# EAGLE design serializer (EAGLE 8.0.0)
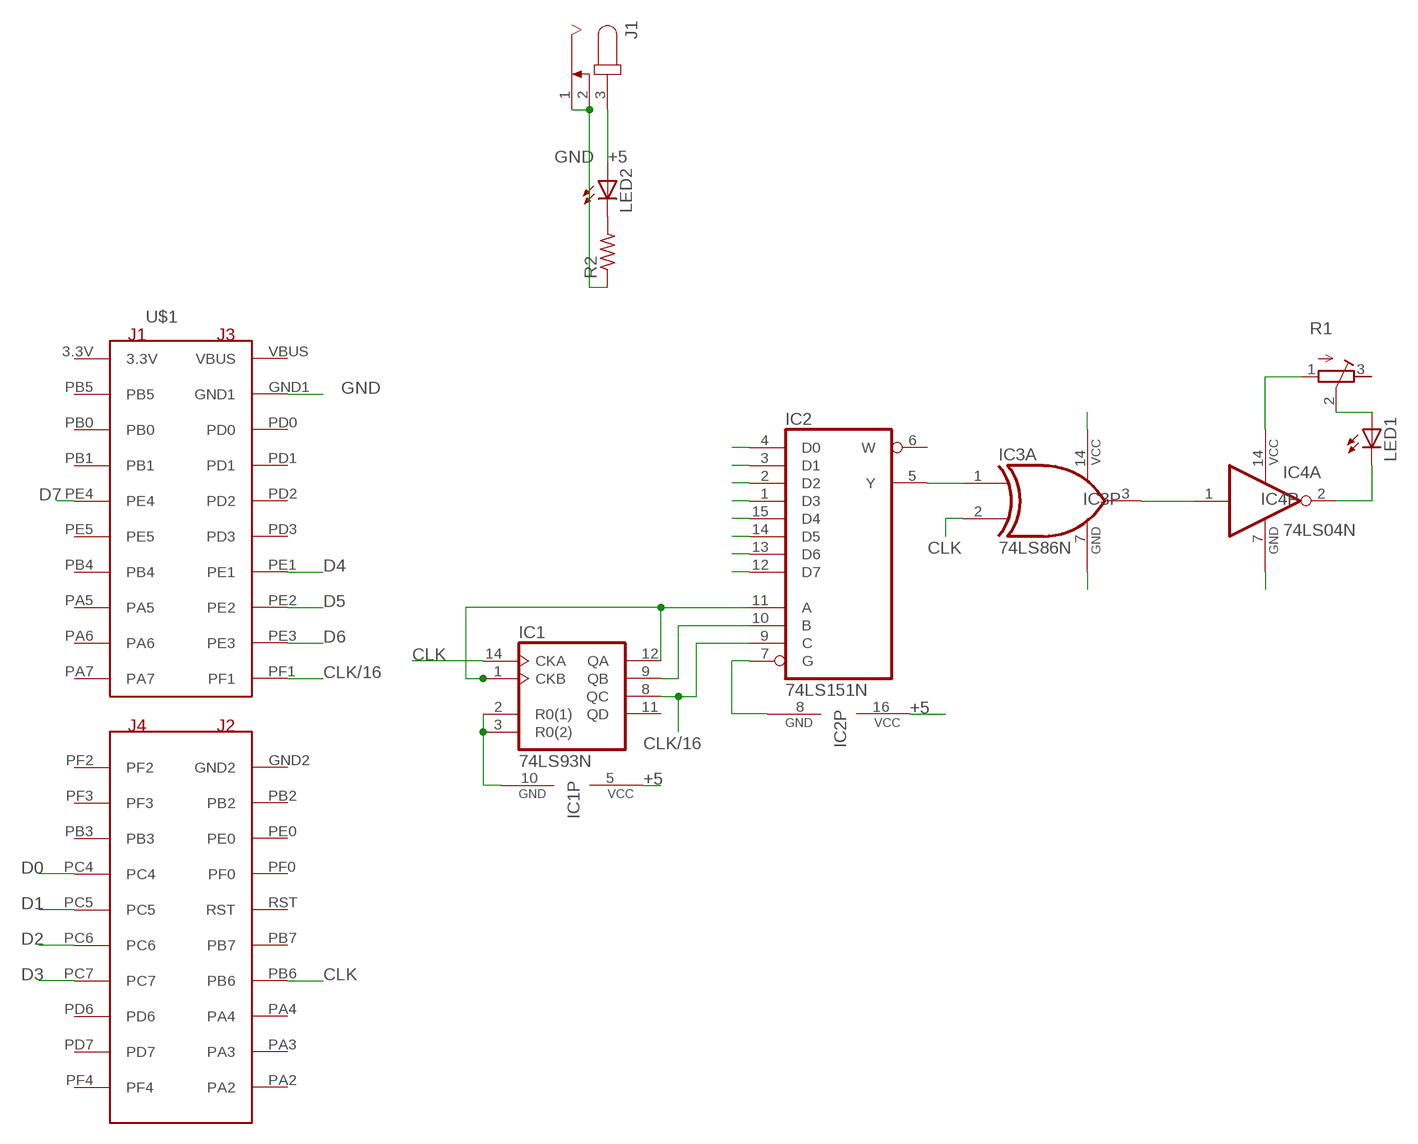
[diagram p0: schematic, sheet 1]

## Parts
IC1  74LS93N  [DIL14]
IC2  74LS151N  [DIL16]
IC3  74LS86N  [DIL14]
IC4  74LS04N  [DIL14]
J1  JACK-PLUG0  [SPC4077]
LED1  LED5MM  [LED5MM]
LED2  LED5MM  [LED5MM]
R1  R-TRIMM3296Y  [RTRIM3296Y]
R2  R-US_0207/10  [0207/10]
U$1  STELLARIS_LAUNCHPAD_BLIZZARD_XL_HEADERS  [STELLARISLAUNCHPADHEADERS]

## Nets
+5: IC1.5(VCC) IC2.16(VCC) IC3.14(P:VCC) IC4.14(P:VCC) J1.3 LED2.A R1.1(A)
CLK: IC1.14(CKA) IC3.2(A:I1) U$1.PB6
CLK/16: IC1.8(QC) IC2.9(C) U$1.PF1
D0: IC2.4(D0) U$1.PC4
D1: IC2.3(D1) U$1.PC5
D2: IC2.2(D2) U$1.PC6
D3: IC2.1(D3) U$1.PC7
D4: IC2.15(D4) U$1.PE1
D5: IC2.14(D5) U$1.PE2
D6: IC2.13(D6) U$1.PE3
D7: IC2.12(D7) U$1.PE4
GND: IC1.2(R0(1)) IC1.3(R0(2)) IC1.10(GND) IC2.7(G) IC2.8(GND) IC3.7(P:GND) IC4.7(P:GND) J1.1 J1.2 R2.1 U$1.GND1
N$1: IC1.9(QB) IC2.10(B)
N$2: LED2.K(C) R2.2
N$3: IC1.1(CKB) IC1.12(QA) IC2.11(A)
N$4: IC3.3(A:O) IC4.1(A:I)
N$5: LED1.A R1.2(S)
N$6: IC4.2(A:O) LED1.K(C)
SEROUT: IC2.5(Y) IC3.1(A:I0)
Unconnected: IC1.11(QD) IC2.6(W) IC3.4(B:I0) IC3.5(B:I1) IC3.6(B:O) IC3.8(C:O) IC3.9(C:I0) IC3.10(C:I1) IC3.11(D:O) IC3.12(D:I0) IC3.13(D:I1) IC4.3(B:I) IC4.4(B:O) IC4.5(C:I) IC4.6(C:O) IC4.8(D:O) IC4.9(D:I) IC4.10(E:O) IC4.11(E:I) IC4.12(F:O) IC4.13(F:I) R1.3(E) U$1.PA2 U$1.PA3 U$1.PA4 U$1.PA5 U$1.PA6 U$1.PA7 U$1.PB0 U$1.PB1 U$1.PB2 U$1.PB3 U$1.PB4 U$1.PB5 U$1.PB7 U$1.PD0 U$1.PD1 U$1.PD2 U$1.PD3 U$1.PD6 U$1.PD7 U$1.PE0 U$1.PE5 U$1.PF0 U$1.PF2 U$1.PF3 U$1.PF4

## Power pins joined to a net without a drawn wire
3.3V: U$1.3.3V
GND2: U$1.GND2
RST: U$1.RST
VBUS: U$1.VBUS

## Library data of the parts
IC1 = 74xx-us:74*93: Decade, divide by twelve and binary COUNTER
IC2 = 74xx-us:74*151: Data SELECTOR/MULTIPLEXER
IC3 = 74xx-us:74*86: Quad 2-input EXCLUSIV-OR (XOR) gate
IC4 = 74xx-us:74*04: Hex INVERTER
J1 = con-jack:JACK-PLUG: DC POWER JACK Power Jack, DC, Right Angle, Through Hole, Rated 5A at 16VDC, PC Terminals Distributor: Farnell (www.Farnell.de) Drawing: 84N1161.pdf / 84N1162.pdf Manufacturer: SPC Technology (www.spctechnology.com) Type: SPC4077 / SPC 4078; OC_FARNELL: unknown; OC_NEWARK: unknown
LED1 LED2 = led:LED: LED OSRAM: - CHIPLED LG R971, LG N971, LY N971, LG Q971, LY Q971, LO R971, LY R971 LH N974, LH R974 LS Q976, LO Q976, LY Q976 LO Q996 - Hyper CHIPLED LW Q18S LB Q993, LB Q99A, LB R99A - SideLED LS A670, LO A670, LY A670, LG A670, LP A670 LB A673, LV A673, LT A673, LW A673 LH A674 LY A675 LS A676, LA A676, LO A676, LY A676, LW A676 LS A679, LY A679, LG A679 - Hyper Micro SIDELED® LS Y876, LA Y876, LO Y876, LY Y876 LT Y87S - SmartLED LW L88C, LW L88S LB L89C, LB L89S, LG L890 LS L89K, LO L89K, LY L89K LS L896, LA L896, LO L896, LY L896 - TOPLED LS T670, LO T670, LY T670, LG T670, LP T670 LSG T670, LSP T670, LSY T670, LOP T670, LYG T670 LG T671, LOG T671, LSG T671 LB T673, LV T673, LT T673, LW T673 LH T674 LS T676, LA T676, LO T676, LY T676, LB T676, LH T676, LSB T676, LW T676 LB T67C, LV T67C, LT T67C, LS T67K, LO T67K, LY T67K, LW E67C LS E67B, LA E67B, LO E67B, LY E67B, LB E67C, LV E67C, LT E67C LW T67C LS T679, LY T679, LG T679 LS T770, LO T770, LY T770, LG T770, LP T770 LB T773, LV T773, LT T773, LW T773 LH T774 LS E675, LA E675, LY E675, LS T675 LS T776, LA T776, LO T776, LY T776, LB T776 LHGB T686 LT T68C, LB T68C - Hyper Mini TOPLED® LB M676 - Mini TOPLED Santana® LG M470 LS M47K, LO M47K, LY M47K Source: http://www.osram.convergy.de LUXEON: - LUMILED® LXK2-PW12-R00, LXK2-PW12-S00, LXK2-PW14-U00, LXK2-PW14-V00 LXK2-PM12-R00, LXK2-PM12-S00, LXK2-PM14-U00 LXK2-PE12-Q00, LXK2-PE12-R00, LXK2-PE12-S00, LXK2-PE14-T00, LXK2-PE14-U00 LXK2-PB12-K00, LXK2-PB12-L00, LXK2-PB12-M00, LXK2-PB14-N00, LXK2-PB14-P00, LXK2-PB14-Q00 LXK2-PR12-L00, LXK2-PR12-M00, LXK2-PR14-Q00, LXK2-PR14-R00 LXK2-PD12-Q00, LXK2-PD12-R00, LXK2-PD12-S00 LXK2-PH12-R00, LXK2-PH12-S00 LXK2-PL12-P00, LXK2-PL12-Q00, LXK2-PL12-R00 Source: www.luxeon.com KINGBRIGHT: KA-3528ASYC Source: www.kingbright.com
R1 = rcl:R-TRIMM: Trimm resistor
R2 = rcl:R-US_: RESISTOR, American symbol
U$1 = AustinBlackstoneEngineeringPublic:STELLARIS_LAUNCHPAD_BLIZZARD_XL_HEADERS: Headers for Blizzard Chipline Stellaris Launchpad XL Booster Packs. Compatible with the EK-LM4F120XL and EK-TM4C123GXL Launchpads. This header can be used to set the headers correctly spaced. The rest of the board should be based around these headers headers that fit these can be ordered from Samtec.com Part Number SSW-110-23-S-D

## Board
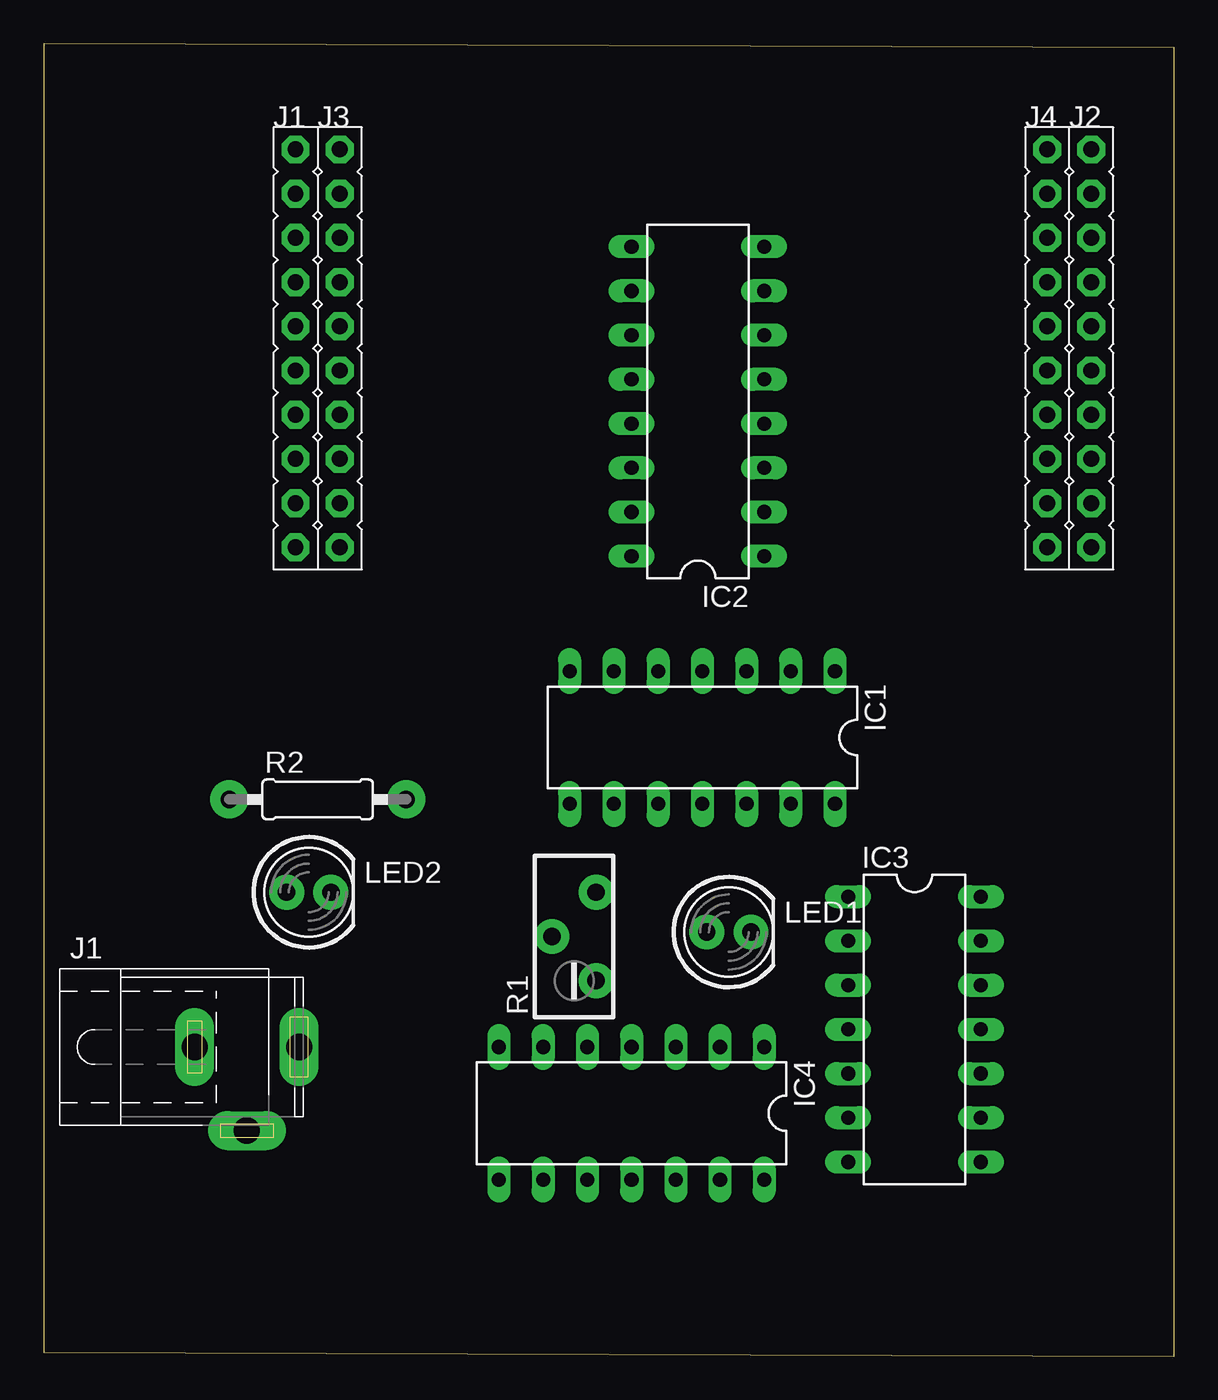
[diagram p1: board, top side]
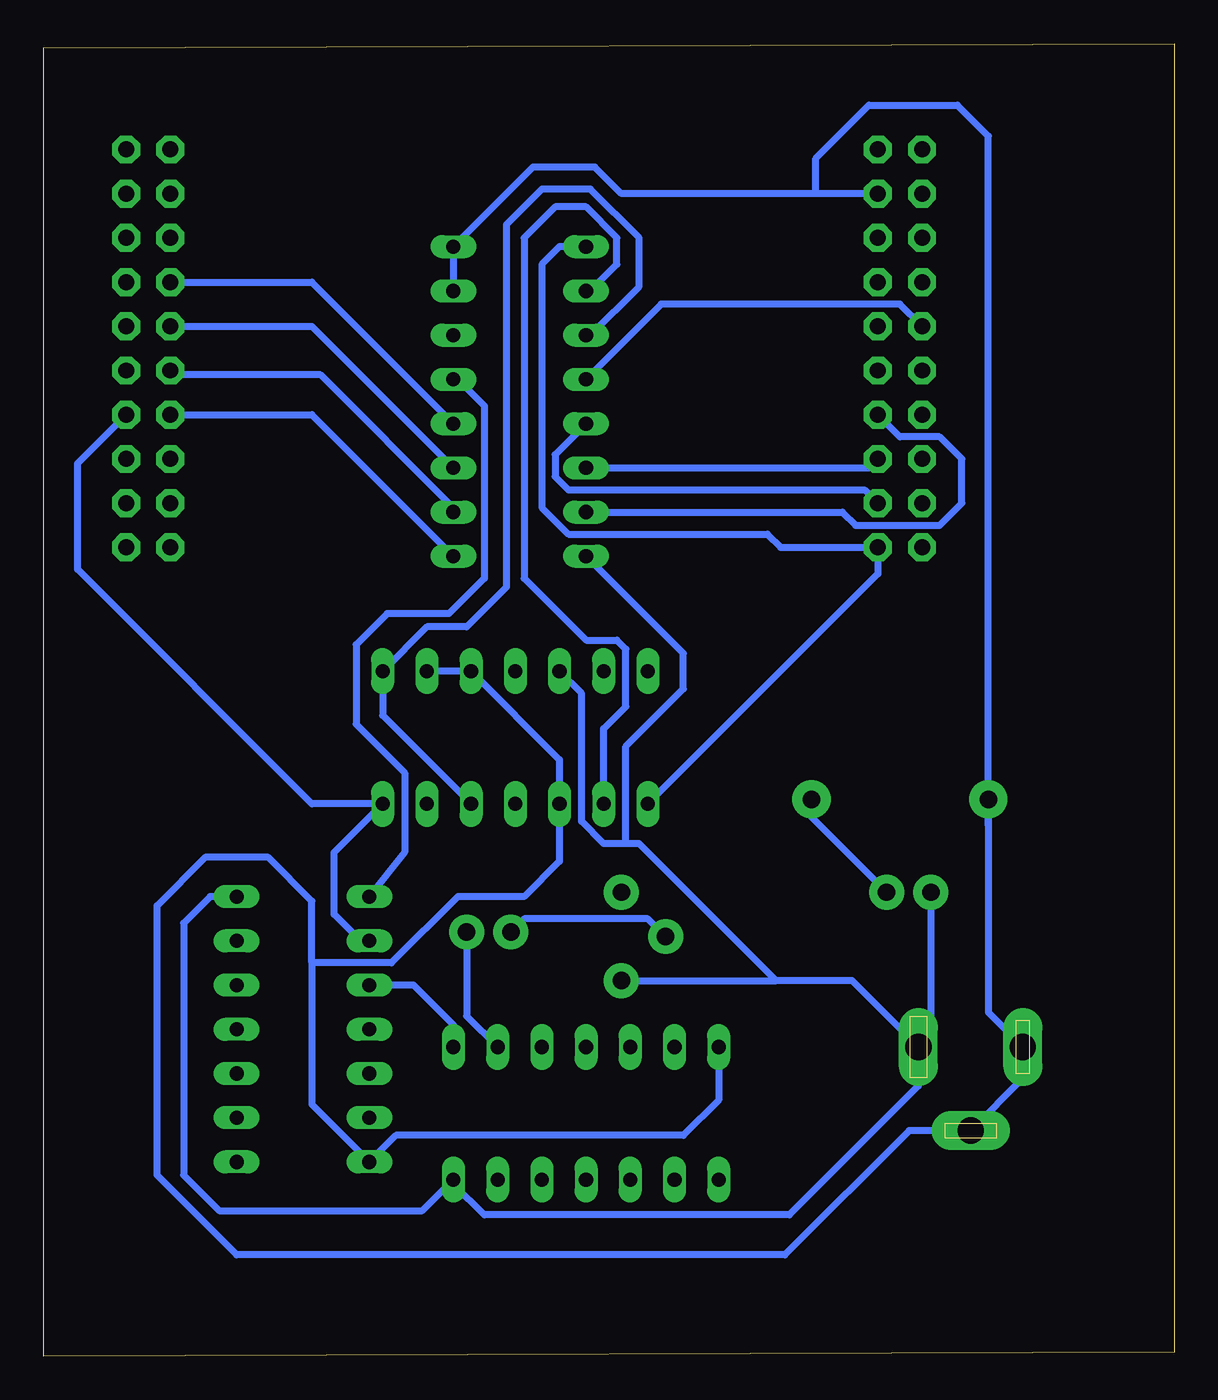
[diagram p2: board, bottom side, seen from below]

Size 64.95 x 75.43 mm. Coordinates in mm from the lower left corner, seen from the top.
Outline: 0,0.25 64.95,0 64.95,75.17 0,75.43 0,0.25
Copper layers (1*16): Top 0.035mm / dielectric 1.5mm / Bottom 0.035mm
Design rules "default": minimum track width 10mil, minimum drill 24mil, track to track 8mil, track to pad 8mil, pad to pad 8mil, via to via 8mil, smd to smd 8mil, copper to edge 40mil, drill to drill 8mil, minimum pad ring 10mil, minimum via ring 8mil, stop-mask expansion 4mil, vias tented up to drill 0mil, thermal gap 10mil

### Footprints (pad centres in the part's own frame; a part is rotated, then mirrored left to right if it is on the bottom)
DIL14 = drill 0.813 long: 1 -7.62,-3.81; 2 -5.08,-3.81; 3 -2.54,-3.81; 4 0,-3.81; 5 2.54,-3.81; 6 5.08,-3.81; 7 7.62,-3.81; 8 7.62,3.81; 9 5.08,3.81; 10 2.54,3.81; 11 0,3.81; 12 -2.54,3.81; 13 -5.08,3.81; 14 -7.62,3.81
DIL16 = drill 0.813 long: 1 -8.89,-3.81; 2 -6.35,-3.81; 3 -3.81,-3.81; 4 -1.27,-3.81; 5 1.27,-3.81; 6 3.81,-3.81; 7 6.35,-3.81; 8 8.89,-3.81; 9 8.89,3.81; 10 6.35,3.81; 11 3.81,3.81; 12 1.27,3.81; 13 -1.27,3.81; 14 -3.81,3.81; 15 -6.35,3.81; 16 -8.89,3.81
SPC4077 = drill 1.5 pad 2.184 long: 1 -3,0; 2 0,-4.8; 3 3,0
LED5MM = drill 1 pad 2: A -1.27,0; K 1.27,0
RTRIM3296Y = drill 1 pad 2: 1 1.27,-2.54; 2 -1.27,0; 3 1.27,2.54
0207/10 = drill 1 pad 2.184: 1 -5.08,0; 2 5.08,0
STELLARISLAUNCHPADHEADERS = drill 0.914 pad 1.6 octagon: 3.3V -22.86,13.97; GND1 -20.32,11.43; GND2 22.86,13.97; PA2 22.86,-8.89; PA3 22.86,-6.35; PA4 22.86,-3.81; PA5 -22.86,-3.81; PA6 -22.86,-6.35; PA7 -22.86,-8.89; PB0 -22.86,8.89; PB1 -22.86,6.35; PB2 22.86,11.43; PB3 20.32,8.89; PB4 -22.86,-1.27; PB5 -22.86,11.43; PB6 22.86,-1.27; PB7 22.86,1.27; PC4 20.32,6.35; PC5 20.32,3.81; PC6 20.32,1.27; PC7 20.32,-1.27; PD0 -20.32,8.89; PD1 -20.32,6.35; PD2 -20.32,3.81; PD3 -20.32,1.27; PD6 20.32,-3.81; PD7 20.32,-6.35; PE0 22.86,8.89; PE1 -20.32,-1.27; PE2 -20.32,-3.81; PE3 -20.32,-6.35; PE4 -22.86,3.81; PE5 -22.86,1.27; PF0 22.86,6.35; PF1 -20.32,-8.89; PF2 20.32,13.97; PF3 20.32,11.43; PF4 20.32,-8.89; RST 22.86,3.81; VBUS -20.32,13.97

### Placement (x,y rotation side)
IC1  37.85,35.56 180 top
IC2  37.59,54.86 90 top
IC3  50.04,18.8 270 top
IC4  33.78,13.97 180 top
J1  11.68,17.78 0 top
LED1  39.37,24.38 0 top
LED2  15.24,26.67 0 top
R1  30.48,24.13 0 top
R2  15.75,32 0 top
U$1  37.34,55.37 0 top

### Tracks (layer width: path | path; a pad name or v marks a point on that pad's centre or on a via)
+5
  Bottom 0.406: IC3.14 55.37,26.42 56.9,24.89 56.9,10.41 54.86,8.38 43.18,8.38 IC4.14 41.4,9.91 39.62,8.13 22.1,8.13 14.68,15.54 J1.3 | R1.1 22.86,21.59 | J1.3 18.49,21.59 22.86,21.59 | 22.86,21.59 30.73,29.46 31.5,29.46 | 31.5,29.46 32.77,29.46 34.04,30.73 34.04,38.1 IC1.5 | 31.5,29.46 31.5,35.05 28.19,38.35 28.19,40.39 IC2.16 | LED2.A 13.97,18.49 J1.3
CLK
  Bottom 0.406: IC3.2 46.74,23.88 48.26,25.4 48.26,28.96 IC1.14 49.53,31.75 62.99,45.21 62.99,51.31 U$1.PB6
CLK/16
  Bottom 0.406: IC2.9 35.31,63.75 36.32,62.74 36.32,48.77 34.8,47.24 23.37,47.24 22.61,46.48 U$1.PF1 17.02,44.96 IC1.8
D0
  Bottom 0.406: U$1.PC4 49.53,61.72 IC2.4
D1
  Bottom 0.406: U$1.PC5 49.53,59.18 IC2.3
D2
  Bottom 0.406: IC2.2 41.4,48.77 49.02,56.39 57.4,56.39 U$1.PC6
D3
  Bottom 0.406: U$1.PC7 49.53,54.1 IC2.1
D4
  Bottom 0.406: IC2.15 19.05,48.51 18.29,47.75 13.46,47.75 12.19,49.02 12.19,51.56 13.46,52.83 15.75,52.83 U$1.PE1
D5
  Bottom 0.406: IC2.14 17.53,51.05 U$1.PE2
D6
  Bottom 0.406: IC2.13 35.56,51.82 35.56,50.55 34.8,49.78 17.78,49.78 U$1.PE3
D7
  Bottom 0.406: U$1.PE4 15.75,60.45 29.46,60.45 IC2.12
GND
  Bottom 0.406: IC1.2 IC1.3 35.31,34.29 IC1.10 35.31,28.45 37.34,26.42 41.15,26.42 44.96,22.61 49.53,22.61 | IC4.7 26.16,14.73 28.19,12.7 44.7,12.7 IC3.7 49.53,14.48 49.53,22.61 | IC2.7 IC2.8 36.83,68.33 33.27,68.33 31.75,66.8 20.57,66.8 | 49.53,22.61 49.53,26.16 52.07,28.7 55.63,28.7 58.42,25.91 58.42,10.41 53.85,5.84 22.35,5.84 15.21,12.98 J1.2 8.68,15.98 J1.1 10.67,19.76 10.67,30.48 | U$1.GND1 20.57,66.8 | 20.57,66.8 20.57,68.83 17.53,71.88 12.45,71.88 10.67,70.1 10.67,30.48 | R2.1 10.67,30.48
N$1
  Bottom 0.406: IC2.10 33.53,61.21 32,62.74 32,64.26 33.78,66.04 35.56,66.04 37.34,64.26 37.34,44.7 33.78,41.15 32,41.15 31.5,40.64 31.5,37.34 32.77,36.07 IC1.9
N$2
  Bottom 0.406: R2.2 20.83,30.99 LED2.K
N$3
  Bottom 0.406: IC2.11 33.53,58.67 30.73,61.47 30.73,64.26 33.53,67.06 36.32,67.06 38.35,65.02 38.35,44.2 40.64,41.91 42.93,41.91 IC1.1 45.47,36.83 IC1.12
N$4
  Bottom 0.406: IC4.1 41.4,19.05 43.69,21.34 IC3.3
N$5
  Bottom 0.406: R1.2 30.23,25.15 37.34,25.15 LED1.A
N$6
  Bottom 0.406: LED1.K 40.64,19.56 IC4.2
SEROUT
  Bottom 0.406: IC2.5 41.15,56.13 39.62,54.61 39.62,44.7 41.66,42.67 45.21,42.67 46.99,40.89 46.99,36.32 44.2,33.53 44.2,28.96 IC3.1